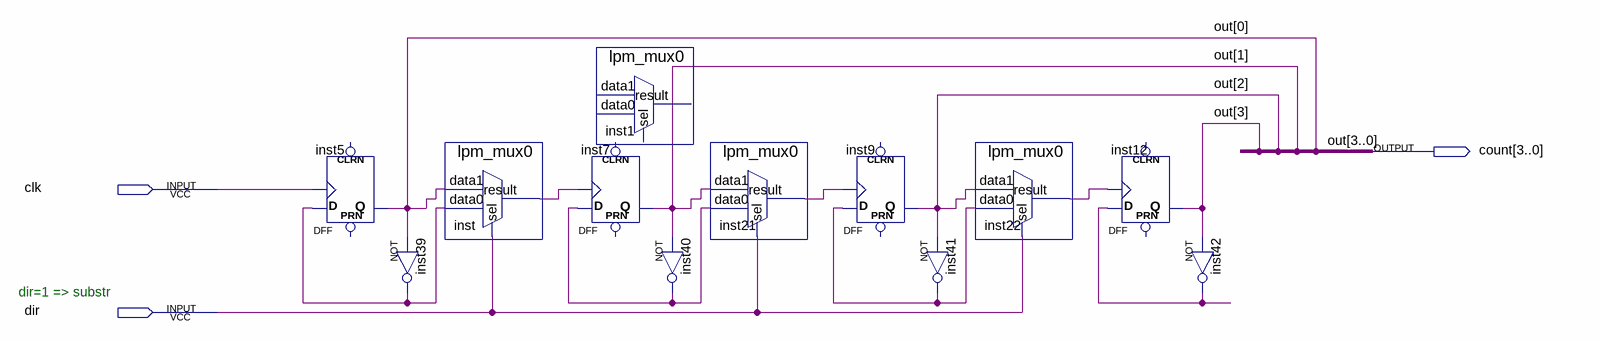
[diagram p0: schematic sheet]
// Quartus schematic counter15.bdf as structural Verilog: 12 symbols, 3 pins
module counter15 (
  input  clk,
  input  dir,
  output [3:0] count
);

  wire inst21_result, inst22_result, inst39_out, inst40_out, inst41_out, inst42_out, inst_result;

  DFF inst5 (.CLK(clk), .D(inst39_out), .Q(count[0]));  // open: CLRN, PRN
  not inst39 (inst39_out, count[0]);
  lpm_mux0 inst (.data1(count[0]), .data0(inst39_out), .sel(dir), .result(inst_result));
  lpm_mux0 inst1 ();  // open: data1, data0, sel, result
  DFF inst7 (.CLK(inst_result), .D(inst40_out), .Q(count[1]));  // open: CLRN, PRN
  lpm_mux0 inst21 (.data1(count[1]), .data0(inst40_out), .sel(dir), .result(inst21_result));
  not inst40 (inst40_out, count[1]);
  DFF inst9 (.CLK(inst21_result), .D(inst41_out), .Q(count[2]));  // open: CLRN, PRN
  not inst41 (inst41_out, count[2]);
  lpm_mux0 inst22 (.data1(count[2]), .data0(inst41_out), .sel(dir), .result(inst22_result));
  DFF inst12 (.CLK(inst22_result), .D(inst42_out), .Q(count[3]));  // open: CLRN, PRN
  not inst42 (inst42_out, count[3]);

  // Other names for the same wires on the sheet: out[3:0] = count

  // Notes on the sheet:
  //   dir=1 => substr
endmodule
